# Altium schematic sheet W25Q128.SchDoc
size A4; SheetNumber: 6; SheetTotal: 17
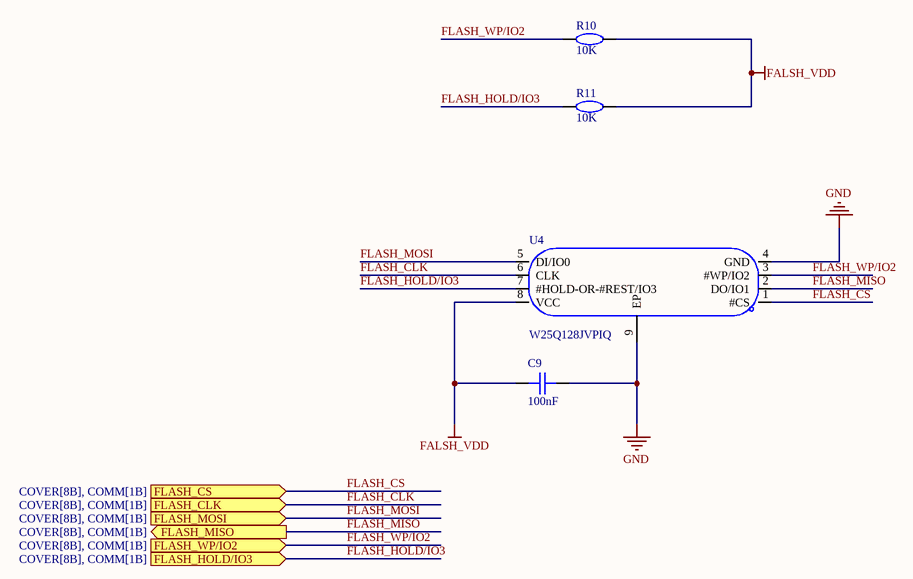
[diagram p0: W25Q128.SchDoc]

## Parts
C9  100nF  [C0402]
R10  10K  [R0402]
R11  10K  [R0402]
U4  W25Q128JVPIQ  [WSON-8_L6.0-W5.0-P1.27-BL-EP]

## Ports
FLASH_CLK (in, see COVER[8B], COMM[1B]), FLASH_CS (in, see COVER[8B], COMM[1B]), FLASH_HOLD/IO3 (in, see COVER[8B], COMM[1B]), FLASH_MISO (out, see COVER[8B], COMM[1B]), FLASH_MOSI (in, see COVER[8B], COMM[1B]), FLASH_WP/IO2 (in, see COVER[8B], COMM[1B])

## Nets
FALSH_VDD: C9.1 R10.2 R11.2 U4.8(VCC)
GND: C9.2 U4.4(GND) U4.9(EP)
FLASH_CLK: U4.6(CLK) ; port FLASH_CLK
FLASH_CS: U4.1(#CS) ; port FLASH_CS
FLASH_HOLD/IO3: R11.1 U4.7(#HOLD-OR-#REST/IO3) ; port FLASH_HOLD/IO3
FLASH_MISO: U4.2(DO/IO1) ; port FLASH_MISO
FLASH_MOSI: U4.5(DI/IO0) ; port FLASH_MOSI
FLASH_WP/IO2: R10.1 U4.3(#WP/IO2) ; port FLASH_WP/IO2

## Library data of the parts
C9 = CAP_0402: Symbol: CapAcitance; Device: CAP_0603; Convert to PCB: yes; Add into BOM: yes; Supplier Footprint: 0603; Value: 100nF; Name: 100nF
R10 R11 = Res_0402: Symbol: 电阻; Device: Res_0603; Convert to PCB: yes; Add into BOM: yes; Supplier Footprint: 0603; Value: 10K; Name: 10K
U4 = W25Q128JVPIQ_C190862: Manufacturer: WINBOND(华邦); Symbol: W25Q128JVPIQTR; Add into BOM: yes; Memory Size: 128Mbit; Device: W25Q128JVPIQ_C190862; LCSC Part Name: W25Q128JVPIQ; Supplier Part: C190862; Manufacturer Part: W25Q128JVPIQ; Supplier Footprint: WSON-8-EP(5x6); Datasheet: https://atta.szlcsc.com/upload/public/pdf/source/20190705/C401662_06B6D416F67ED315879B366F63A3F7C9.pdf; Supplier: LCSC; Convert to PCB: yes; Name: W25Q128JVPIQ